# Altium schematic sheet Memory Address Register.SchDoc
size B; Author: E. Sims; Organization: Let's Build Rockets Inc.; SheetNumber: 2; SheetTotal: 4
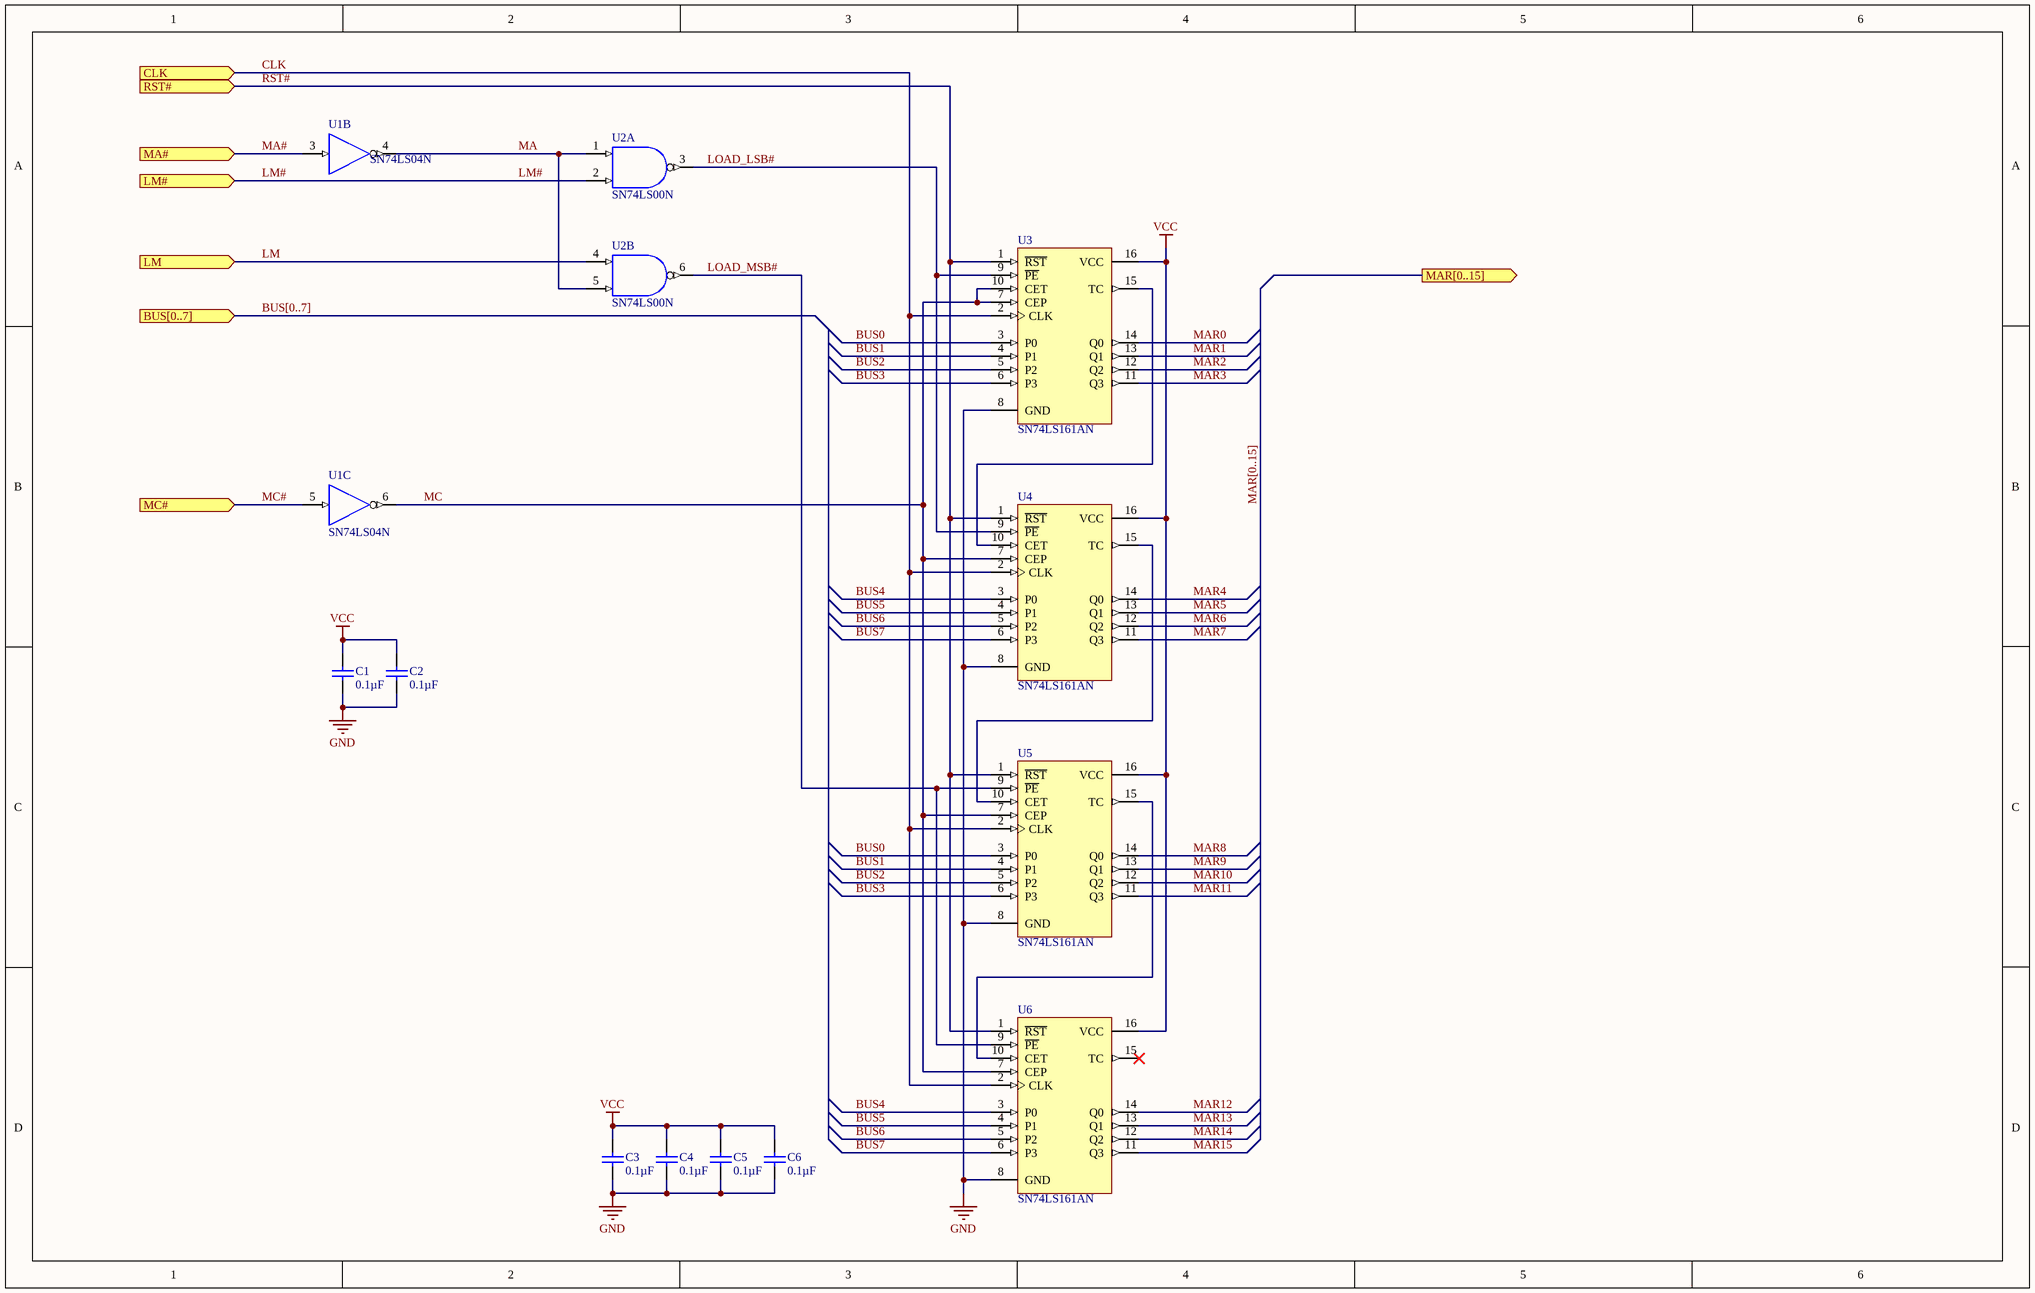
[diagram p0: Memory Address Register.SchDoc]

## Parts
C1  Capacitance: 0.1µF  [VISH-K104K15X7RF5TL2]  (hidden comment: K104K15X7RF5TL2)
C2  Capacitance: 0.1µF  [VISH-K104K15X7RF5TL2]  (hidden comment: K104K15X7RF5TL2)
C3  Capacitance: 0.1µF  [VISH-K104K15X7RF5TL2]  (hidden comment: K104K15X7RF5TL2)
C4  Capacitance: 0.1µF  [VISH-K104K15X7RF5TL2]  (hidden comment: K104K15X7RF5TL2)
C5  Capacitance: 0.1µF  [VISH-K104K15X7RF5TL2]  (hidden comment: K104K15X7RF5TL2)
C6  Capacitance: 0.1µF  [VISH-K104K15X7RF5TL2]  (hidden comment: K104K15X7RF5TL2)
U1  SN74LS04N  [N014]  (parts B,C of 6)
U2  SN74LS00N  [N014]  (parts A,B of 4)
U3  SN74LS161AN  [N016]
U4  SN74LS161AN  [N016]
U5  SN74LS161AN  [N016]
U6  SN74LS161AN  [N016]

## Ports
BUS[0..7] (in), CLK (in), LM (in), LM# (in), MA# (in), MAR[0..15] (out), MC# (in), RST# (in)

## Nets
GND: C1.2 C2.2 C3.2 C4.2 C5.2 C6.2 U1.7(GND) U2.7(GND) U3.8(GND) U4.8(GND) U5.8(GND) U6.8(GND)
VCC: C1.1 C2.1 C3.1 C4.1 C5.1 C6.1 U1.14(VCC) U2.14(VCC) U3.16(VCC) U4.16(VCC) U5.16(VCC) U6.16(VCC)
BUS0: U3.3(P0) U5.3(P0)
BUS1: U3.4(P1) U5.4(P1)
BUS2: U3.5(P2) U5.5(P2)
BUS3: U3.6(P3) U5.6(P3)
BUS4: U4.3(P0) U6.3(P0)
BUS5: U4.4(P1) U6.4(P1)
BUS6: U4.5(P2) U6.5(P2)
BUS7: U4.6(P3) U6.6(P3)
CLK: U3.2(CLK) U4.2(CLK) U5.2(CLK) U6.2(CLK) ; port CLK
LM: U2.4(A) ; port LM
LM#: U2.2(B) ; port LM#
LOAD_LSB#: U2.3(Y) U3.9(~{PE}) U4.9(~{PE})
LOAD_MSB#: U2.6(Y) U5.9(~{PE}) U6.9(~{PE})
MA: U1.4(Y) U2.1(A) U2.5(B)
MA#: U1.3(A) ; port MA#
MAR0: U3.14(Q0)
MAR1: U3.13(Q1)
MAR2: U3.12(Q2)
MAR3: U3.11(Q3)
MAR4: U4.14(Q0)
MAR5: U4.13(Q1)
MAR6: U4.12(Q2)
MAR7: U4.11(Q3)
MAR8: U5.14(Q0)
MAR9: U5.13(Q1)
MAR10: U5.12(Q2)
MAR11: U5.11(Q3)
MAR12: U6.14(Q0)
MAR13: U6.13(Q1)
MAR14: U6.12(Q2)
MAR15: U6.11(Q3)
MC: U1.6(Y) U3.7(CEP) U3.10(CET) U4.7(CEP) U5.7(CEP) U6.7(CEP)
MC#: U1.5(A) ; port MC#
RST#: U3.1(~{RST}) U4.1(~{RST}) U5.1(~{RST}) U6.1(~{RST}) ; port RST#
NetU3_15: U3.15(TC) U4.10(CET)
NetU4_15: U4.15(TC) U5.10(CET)
NetU5_15: U5.15(TC) U6.10(CET)

Not connected (* = marked no-connect by the designer): U6 15(TC)*

## Buses and harness runs
bus BUS[0..7] = port BUS[0..7]
bus MAR[0..15] = port MAR[0..15]

## Notes on the sheet
- Let's Build Rocket's Inc. Modular Paylaod System Based on TMP-010 Rev
  For more information visit https://github.com/LetsBuildRockets/Modular-Payload-System
  This work is licensed under CC BY-NC 4.0. To view a copy of this license, visit https://creativecommons.org/licenses/by-nc/4.0
- Title
- Size:
- Date:
- Assembly Variant:
- B
- Number:
- Time:
- Revision:
- Sheet
- of
- Author:
- File:

## Library data of the parts
C1-C6 = CMP-2000-06508-1: Ceramic Capacitor, 100 nF, +/- 10%, 50 V, -55 to 125 degC, 2-Pin THD, RoHS, Tape and Reel; Manufacturer: Vishay; Other Names: BC1084CT; Catalog Drawings: Mono-KapSide2-15_5.58Mono-KapSide1_15; Temperature Coefficient: X7R; Voltage - Rated: 50V; Online Catalog: Mono-Kap™Series; Size / Dimension: 0.157"Lx0.098"W(4.00mmx2.50mm); Operating Temperature: -55°C~125°C; Family: CeramicCapacitors; Manufacturer URL: http://www.vishay.com/; Standard Package: 1; Thickness (Max): -; Ratings: -; Datasheet Version: 08/2013; Package Description: 2-Pin Through Hole Device, Body 4 x 2.6 mm; Mounting Type: ThroughHole; Features: -; Lead Spacing: 0.098"(2.50mm); Tolerance: ±10%; Category: Capacitors; Mounting Technology: ThroughHole; Lead Style: Straight; Datasheet URL: http://www.vishay.com/docs/45171/kseries.pdf; Applications: GeneralPurpose; Package / Case: Radial; Height - Seated (Max): 0.220"(5.58mm); Package Reference: K104K15X7RF5TL2; Series: Mono-Kap™K; Packaging: CutTape(CT)
U1 = SN74LS04N: Hex Inverter; Published: 8-Jun-2000; LatestRevisionDate: 04-Mar-2005; LatestRevisionNote: Stylized 3D Model Added.; DatasheetVersion: Mar-1988; PackageVersion: Oct-1995; PackageReference: N014; Publisher: Altium Limited; PackageDescription: DIP; 14 Leads; Row Spacing 7.62 mm; Pitch 2.54 mm; ComponentLink1Description: Manufacturer Link; ComponentLink1URL: http://www.ti.com/; ComponentLink2Description: Datasheet; ComponentLink2URL: http://www-s.ti.com/sc/ds/sn74ls04.pdf
U2 = SN74LS00N: Quadruple 2-Input Positive-NAND Gate; Published: 8-Jun-2000; LatestRevisionDate: 04-Mar-2005; LatestRevisionNote: Stylized 3D Model Added.; DatasheetVersion: Mar-1988; PackageVersion: Oct-1995; PackageReference: N014; Publisher: Altium Limited; PackageDescription: DIP; 14 Leads; Row Spacing 7.62 mm; Pitch 2.54 mm; ComponentLink1Description: Manufacturer Link; ComponentLink1URL: http://www.ti.com/; ComponentLink2Description: Datasheet; ComponentLink2URL: http://www-s.ti.com/sc/ds/sn74ls00.pdf
U3-U6 = SN74LS161AN: Synchronous 4-Bit Counter; Published: 8-Jun-2000; LatestRevisionDate: 04-Mar-2005; LatestRevisionNote: Stylized 3D Model Added.; DatasheetVersion: Mar-1988; PackageVersion: Oct-1995; PackageReference: N016; Publisher: Altium Limited; PackageDescription: DIP; 16 Leads; Row Spacing 7.62 mm; Pitch 2.54 mm; Code_JEDEC: MS-001-BB; ComponentLink1Description: Manufacturer Link; ComponentLink1URL: http://www.ti.com/; ComponentLink2Description: Datasheet; ComponentLink2URL: http://www-s.ti.com/sc/ds/sn74ls161a.pdf; ComponentLink3Description: URL Link1; ComponentLink3URL: http://focus.ti.com/docs/prod/folders/print/sn74ls161a.html